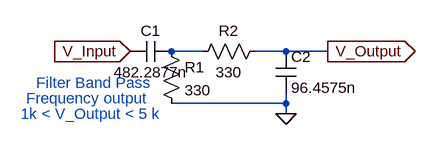
[diagram p0: schematic Band_Pass_1k_5K.asc]
Band_Pass_1k_5K.asc, the LTspice schematic file:
Version 4
SHEET 1 880 680
WIRE 176 128 128 128
WIRE 304 128 256 128
WIRE 368 128 304 128
WIRE 304 208 304 192
WIRE 304 208 128 208
WIRE 304 224 304 208
FLAG 64 128 V_Input
IOPIN 64 128 In
FLAG 368 128 V_Output
IOPIN 368 128 Out
FLAG 304 224 0
SYMBOL cap 128 112 R90
WINDOW 0 0 32 VBottom 2
WINDOW 3 32 32 VTop 2
SYMATTR InstName C1
SYMATTR Value 482.2877n
SYMBOL res 112 112 R0
SYMATTR InstName R1
SYMATTR Value 330
SYMBOL res 272 112 R90
WINDOW 0 0 56 VBottom 2
WINDOW 3 32 56 VTop 2
SYMATTR InstName R2
SYMATTR Value 330
SYMBOL cap 288 128 R0
SYMATTR InstName C2
SYMATTR Value 96.4575n
TEXT -80 176 Left 2 ;Filter Band Pass
TEXT -96 200 Left 2 ;Frequency output
TEXT -104 224 Left 2 ;1k < V_Output < 5 k

The netlist it stands for:
* Band_Pass_1k_5K.asc
C1 N001 V_Input 482.2877n
R1 N001 0 330
R2 V_Output N001 330
C2 V_Output 0 96.4575n
* Filter Band Pass
* Frequency output
* 1k < V_Output < 5 k
.backanno
.end